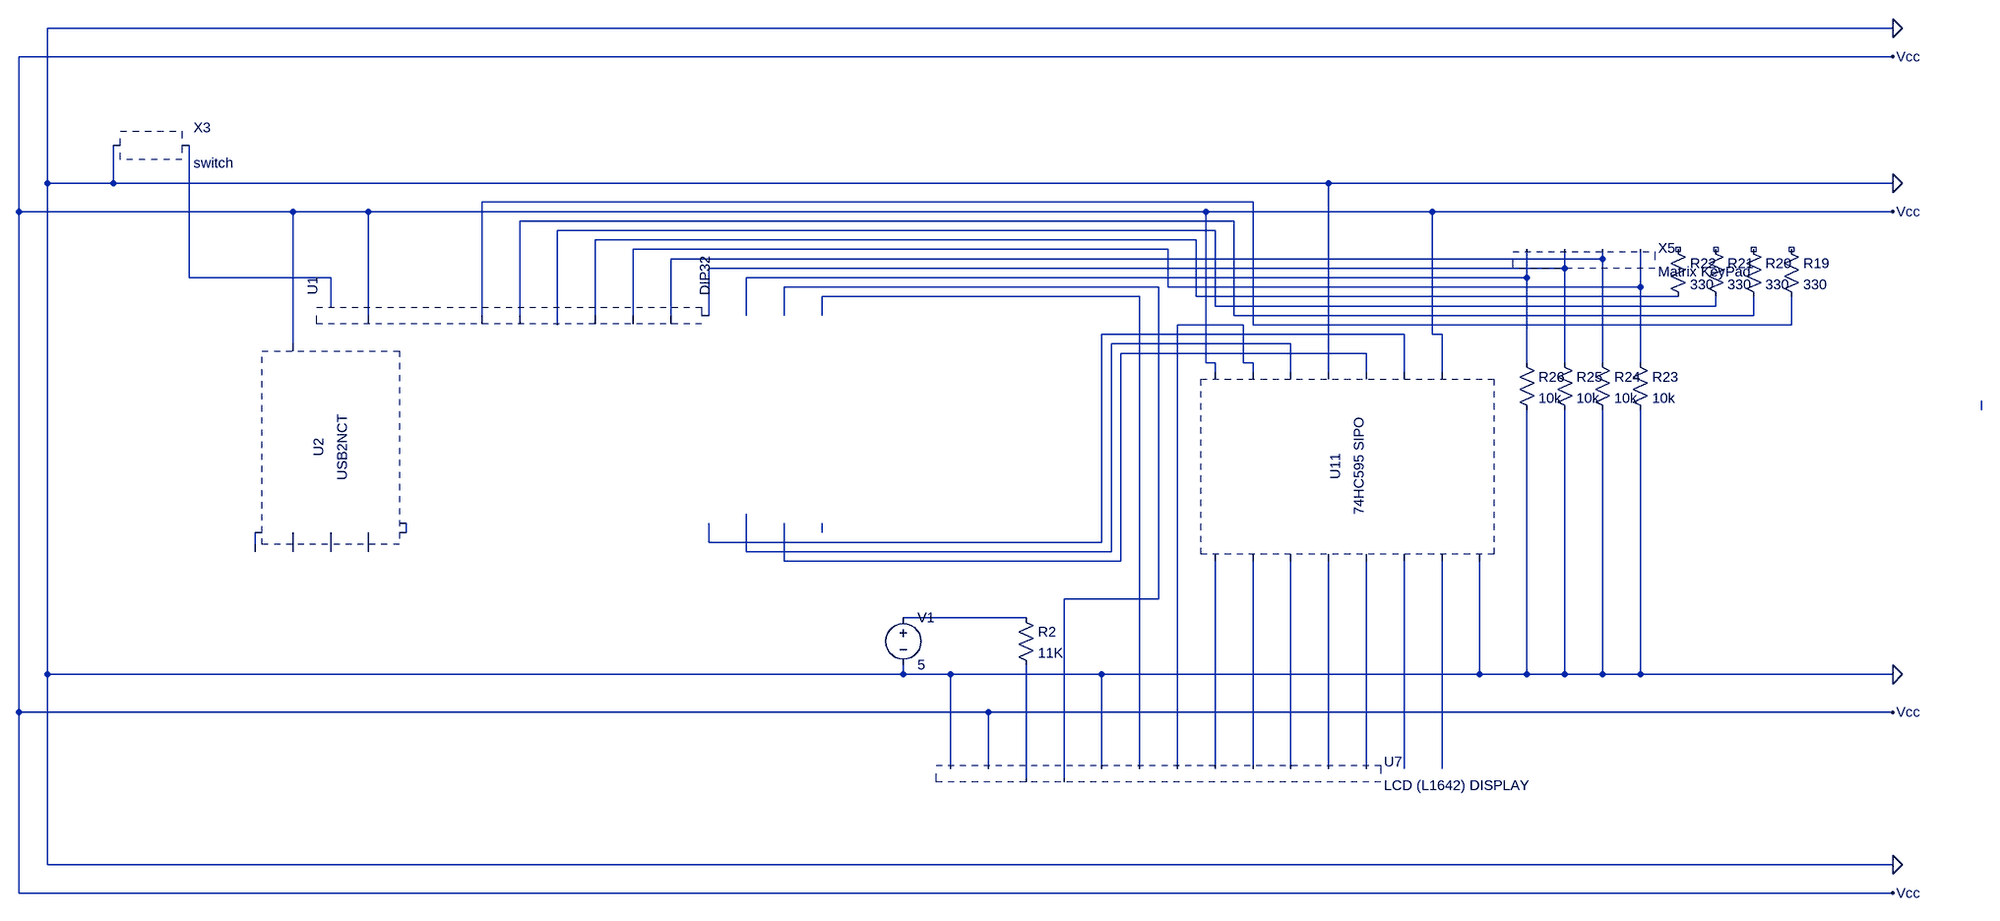
[diagram p0: schematic Lab 12 Circuit Schematic.asc]
Lab 12 Circuit Schematic.asc, the LTspice schematic file:
Version 4
SHEET 1 3364 740
WIRE 2192 -1680 -1120 -1680
WIRE 2192 -1632 -1168 -1632
WIRE -1120 -1216 -1120 -1680
WIRE -1008 -1216 -1008 -1280
WIRE -1008 -1216 -1120 -1216
WIRE 1168 -1216 -1008 -1216
WIRE 2192 -1216 1168 -1216
WIRE 1040 -1184 -384 -1184
WIRE -1168 -1168 -1168 -1632
WIRE -704 -1168 -1168 -1168
WIRE -576 -1168 -704 -1168
WIRE 960 -1168 -576 -1168
WIRE 1344 -1168 960 -1168
WIRE 2192 -1168 1344 -1168
WIRE 1008 -1152 -320 -1152
WIRE 976 -1136 -256 -1136
WIRE 944 -1120 -192 -1120
WIRE 896 -1104 -128 -1104
WIRE 1632 -1088 1632 -1104
WIRE 1632 -1088 -64 -1088
WIRE 1568 -1072 1568 -1104
WIRE 1568 -1072 0 -1072
WIRE -880 -1056 -880 -1280
WIRE -640 -1056 -880 -1056
WIRE 1504 -1056 1504 -1104
WIRE 1504 -1056 64 -1056
WIRE 880 -1040 128 -1040
WIRE 896 -1040 896 -1104
WIRE 1696 -1040 1696 -1104
WIRE 1696 -1040 896 -1040
WIRE 848 -1024 192 -1024
WIRE 944 -1024 944 -1120
WIRE 1760 -1024 944 -1024
WIRE -704 -1008 -704 -1168
WIRE -640 -1008 -640 -1056
WIRE -576 -1008 -576 -1168
WIRE -384 -1008 -384 -1184
WIRE -320 -1008 -320 -1152
WIRE -256 -1008 -256 -1136
WIRE -192 -1008 -192 -1120
WIRE -128 -1008 -128 -1104
WIRE -64 -1008 -64 -1088
WIRE 0 -1008 0 -1072
WIRE 64 -1008 64 -1056
WIRE 128 -1008 128 -1040
WIRE 192 -1008 192 -1024
WIRE 976 -1008 976 -1136
WIRE 1824 -1008 1824 -1024
WIRE 1824 -1008 976 -1008
WIRE -576 -992 -576 -1008
WIRE -384 -992 -384 -1008
WIRE -320 -992 -320 -1008
WIRE -192 -992 -192 -1008
WIRE -128 -992 -128 -1008
WIRE -64 -992 -64 -1008
WIRE 0 -992 0 -1008
WIRE 64 -992 64 -1008
WIRE 128 -992 128 -1008
WIRE 192 -992 192 -1008
WIRE 1008 -992 1008 -1152
WIRE 1888 -992 1888 -1024
WIRE 1888 -992 1008 -992
WIRE -256 -976 -256 -1008
WIRE 1024 -976 912 -976
WIRE 1040 -976 1040 -1184
WIRE 1952 -976 1952 -1024
WIRE 1952 -976 1040 -976
WIRE 1296 -960 784 -960
WIRE 1344 -960 1344 -1168
WIRE 1360 -960 1344 -960
WIRE -704 -944 -704 -1008
WIRE 1104 -944 800 -944
WIRE 1232 -928 816 -928
WIRE 960 -912 960 -1168
WIRE 976 -912 960 -912
WIRE 1024 -912 1024 -976
WIRE 1040 -912 1024 -912
WIRE 1504 -912 1504 -1056
WIRE 1568 -912 1568 -1072
WIRE 1632 -912 1632 -1088
WIRE 1696 -912 1696 -1040
WIRE 976 -896 976 -912
WIRE 1040 -896 1040 -912
WIRE 1104 -896 1104 -944
WIRE 1168 -896 1168 -1216
WIRE 1232 -896 1232 -928
WIRE 1296 -896 1296 -960
WIRE 1360 -896 1360 -960
WIRE 2512 -832 2512 -848
WIRE -512 -624 -512 -640
WIRE 0 -624 0 -640
WIRE 64 -624 64 -656
WIRE 128 -624 128 -640
WIRE 192 -624 192 -640
WIRE 0 -608 0 -624
WIRE 784 -608 784 -960
WIRE 784 -608 0 -608
WIRE -768 -592 -768 -624
WIRE -704 -592 -704 -624
WIRE -640 -592 -640 -624
WIRE -576 -592 -576 -624
WIRE 64 -592 64 -624
WIRE 800 -592 800 -944
WIRE 800 -592 64 -592
WIRE 128 -576 128 -624
WIRE 816 -576 816 -928
WIRE 816 -576 128 -576
WIRE 880 -512 880 -1040
WIRE 880 -512 720 -512
WIRE 656 -480 448 -480
WIRE -1120 -384 -1120 -1216
WIRE -960 -384 -1120 -384
WIRE 448 -384 448 -400
WIRE 448 -384 -960 -384
WIRE 528 -384 448 -384
WIRE 784 -384 528 -384
WIRE 1424 -384 1424 -576
WIRE 1424 -384 784 -384
WIRE 1504 -384 1504 -832
WIRE 1504 -384 1424 -384
WIRE 1568 -384 1568 -832
WIRE 1568 -384 1504 -384
WIRE 1632 -384 1632 -832
WIRE 1632 -384 1568 -384
WIRE 1696 -384 1696 -832
WIRE 1696 -384 1632 -384
WIRE 2192 -384 1696 -384
WIRE -1168 -320 -1168 -1168
WIRE -960 -320 -1168 -320
WIRE 592 -320 -960 -320
WIRE 2192 -320 592 -320
WIRE 528 -224 528 -384
WIRE 592 -224 592 -320
WIRE 656 -224 656 -400
WIRE 720 -224 720 -512
WIRE 784 -224 784 -384
WIRE 848 -224 848 -1024
WIRE 912 -224 912 -976
WIRE 976 -224 976 -576
WIRE 1040 -224 1040 -576
WIRE 1104 -224 1104 -576
WIRE 1168 -224 1168 -576
WIRE 1232 -224 1232 -576
WIRE 1296 -224 1296 -576
WIRE 1360 -224 1360 -576
WIRE 656 -208 656 -224
WIRE 720 -208 720 -224
WIRE -1120 320 -1120 -384
WIRE 2192 320 -1120 320
WIRE -1168 368 -1168 -320
WIRE 2192 368 -1168 368
FLAG 2192 -1680 0
FLAG 2192 -1216 0
FLAG 2192 -384 0
FLAG 2192 320 0
FLAG 2192 -1632 Vcc
FLAG 2192 -1168 Vcc
FLAG 2192 -320 Vcc
FLAG 2192 368 Vcc
SYMBOL Misc\\DIP32 -464 -848 R270
SYMATTR InstName U1
SYMBOL Misc\\USB2NCT -736 -656 R270
SYMATTR InstName U2
SYMBOL switch -880 -1280 R0
SYMATTR InstName X3
SYMBOL Matrix\ KeyPad 1648 -1120 R0
SYMATTR InstName X5
SYMBOL res 1936 -1120 R0
SYMATTR InstName R19
SYMATTR Value 330
SYMBOL res 1872 -1120 R0
SYMATTR InstName R20
SYMATTR Value 330
SYMBOL res 1808 -1120 R0
SYMATTR InstName R21
SYMATTR Value 330
SYMBOL res 1744 -1120 R0
SYMATTR InstName R22
SYMATTR Value 330
SYMBOL res 1680 -928 R0
SYMATTR InstName R23
SYMATTR Value 10k
SYMBOL res 1616 -928 R0
SYMATTR InstName R24
SYMATTR Value 10k
SYMBOL res 1552 -928 R0
SYMATTR InstName R25
SYMATTR Value 10k
SYMBOL res 1488 -928 R0
SYMATTR InstName R26
SYMATTR Value 10k
SYMBOL 74HC595\ SIPO 1056 -720 R270
SYMATTR InstName U11
SYMBOL LCD\ (L1642)\ DISPLAY 672 -288 R0
SYMATTR InstName U7
SYMBOL voltage 448 -496 R0
WINDOW 123 0 0 Left 2
WINDOW 39 0 0 Left 2
SYMATTR InstName V1
SYMATTR Value 5
SYMBOL res 640 -496 R0
SYMATTR InstName R2
SYMATTR Value 11K

The netlist it stands for:
* Lab 12 Circuit Schematic.asc
* U1: DIP32 (symbol Misc\DIP32 not available, pin order unknown); nets seen at it: N001, N002, N003, N004, N005, N006, N007, N008, Vcc
* U2: USB2NCT (symbol Misc\USB2NCT not available, pin order unknown); nets seen at it: N017, N019, N020, N021, N022, Vcc
* X3: switch (symbol switch not available, pin order unknown); nets seen at it: 0, N008
* X5: Matrix KeyPad (symbol Matrix KeyPad not available, pin order unknown); nets seen at it: N005, N006, N007, N009
R19 NC_01 N001 330
R20 NC_02 N002 330
R21 NC_03 N003 330
R22 NC_04 N004 330
R23 N005 0 10k
R24 N006 0 10k
R25 N007 0 10k
R26 N009 0 10k
* U11: 74HC595 SIPO (symbol 74HC595 SIPO not available, pin order unknown); nets seen at it: 0, N012, N013, N014, N015, N025, N026, N027, N028, N029, N030, N031, Vcc
* U7: LCD (L1642) DISPLAY (symbol LCD (L1642) DISPLAY not available, pin order unknown); nets seen at it: 0, N010, N011, N012, N024, N025, N026, N027, N028, N029, Vcc
V1 N023 0 5
R2 N023 N024 11K
.backanno
.end